# EAGLE design ReflowOvenController (EAGLE 7.6.0)
AUTHOR: w. boyett; CONTACT_ADDRESS: Licensed under CC-BY-SA; CONTACT_COMPANY: github.com/watsonboyett; CONTACT_PHONE: (Creative Commons, Attribution + Share Alike); REV: 1B
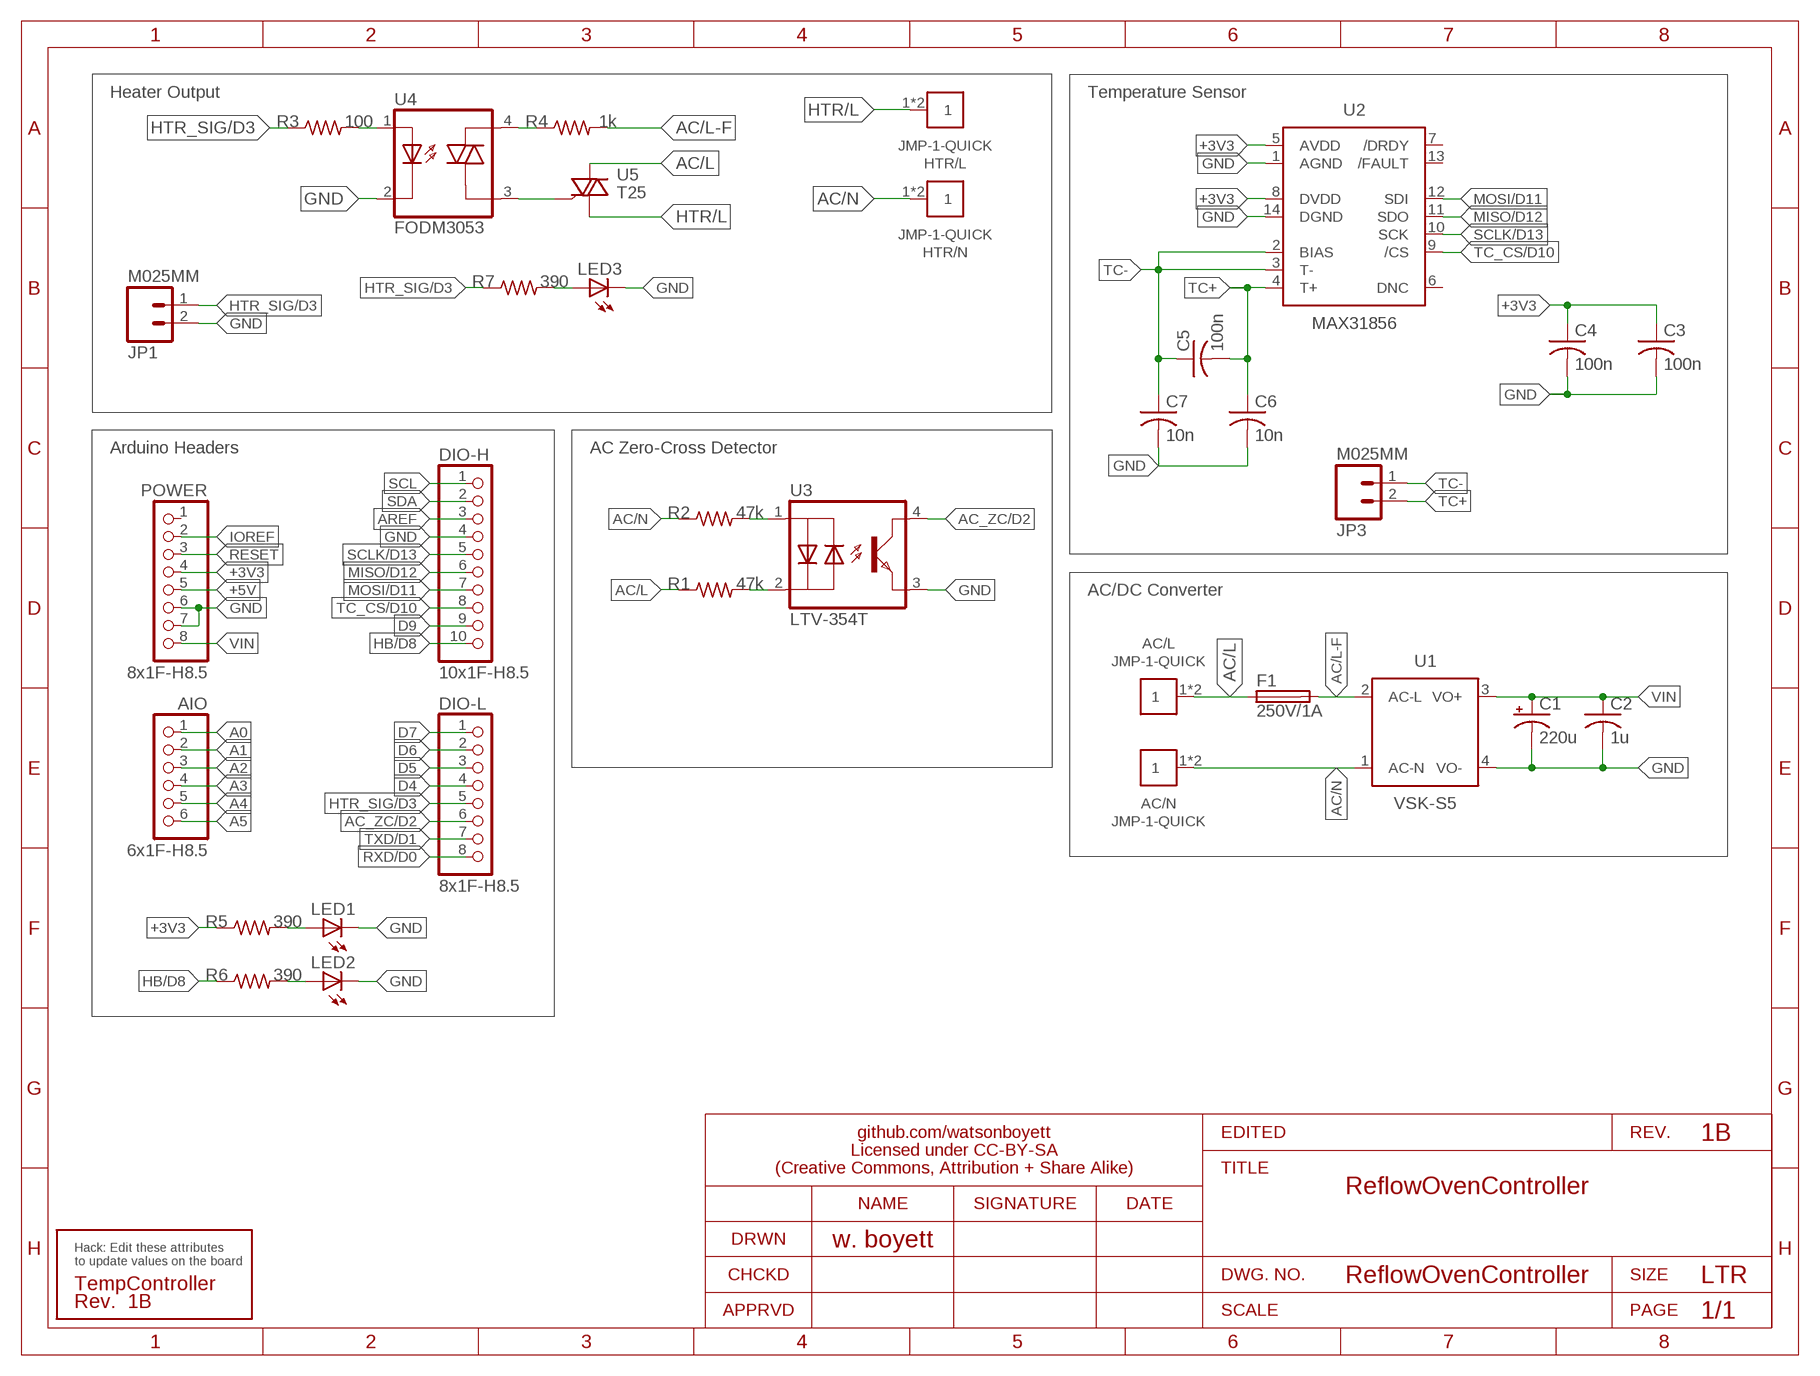
[diagram p0: schematic, sheet 1]

## Parts
AC/L  JMP-1-QUICK  [QUICK-1]
AC/N  JMP-1-QUICK  [QUICK-1]
AIO  6x1F-H8.5  PINHD-1X6TH  [1X06]
C1  220u  CPOL-US153CLV-1014  [153CLV-1014]
C2  1u  C-USC0805  [C0805]
C3  100n  C-USC0805  [C0805]
C4  100n  C-USC0805  [C0805]
C5  100n  C-USC0805  [C0805]
C6  10n  C-USC0805  [C0805]
C7  10n  C-USC0805  [C0805]
DIO-H  10x1F-H8.5  PINHD-1X10TH  [1X10]
DIO-L  8x1F-H8.5  PINHD-1X8TH  [1X08]
F1  250V/1A  FUSE2410  [2SMD-2410]
HTR/L  JMP-1-QUICK  [QUICK-1]
HTR/N  JMP-1-QUICK  [QUICK-1]
JP1  M025MM  [SCREWTERMINAL-5MM-2]
JP3  M025MM  [SCREWTERMINAL-5MM-2]
LED1  LEDCHIP-LED0805  [CHIP-LED0805]
LED2  LEDCHIP-LED0805  [CHIP-LED0805]
LED3  LEDCHIP-LED0805  [CHIP-LED0805]
POWER  8x1F-H8.5  PINHD-1X8TH  [1X08]
R1  47k  R-US_R1206  [R1206]
R2  47k  R-US_R1206  [R1206]
R3  100  R-US_R0805  [R0805]
R4  1k  R-US_R1206  [R1206]
R5  390  R-US_R0805  [R0805]
R6  390  R-US_R0805  [R0805]
R7  390  R-US_R0805  [R0805]
U1  VSK-S5  [VSK-S5]
U2  MAX31856  [TSSOP14]
U3  LTV-354T  [SOP-4]
U4  FODM3053  [SOP-4]
U5  T25  T835-TO263  [TO263-3]
U$1  SILK_QC  [SILK_QC]

## Nets
+3V3: C3.1 C4.1 POWER.4 R5.1 U2.5(AVDD) U2.8(DVDD)
+5V: POWER.5
A0: AIO.1
A1: AIO.2
A2: AIO.3
A3: AIO.4
A4: AIO.5
A5: AIO.6
AC/L [MAINS-HC]: AC/L.1 AC/L.2 F1.P$1 R1.1 U5.3(A2)
AC/L-F [MAINS-LC]: F1.P$2 R4.2 U1.2(AC-L)
AC/N [MAINS-HC]: AC/N.1 AC/N.2 HTR/N.1 HTR/N.2 R2.1 U1.1(AC-N)
AC_ZC/D2: DIO-L.6 U3.4(COL)
AREF: DIO-H.3
D4: DIO-L.4
D5: DIO-L.3
D6: DIO-L.2
D7: DIO-L.1
D9: DIO-H.9
GND: C1.- C2.2 C3.2 C4.2 C6.2 C7.2 DIO-H.4 JP1.2 LED1.C LED2.C LED3.C POWER.6 POWER.7 U1.4(VO-) U2.1(AGND) U2.14(DGND) U3.3(EMIT) U4.2(C)
HB/D8: DIO-H.10 R6.1
HTR/L [MAINS-HC]: HTR/L.1 HTR/L.2 U5.1(A1)
HTR_SIG/D3: DIO-L.5 JP1.1 R3.1 R7.1
IOREF: POWER.2
MISO/D12: DIO-H.6 U2.11(SDO)
MOSI/D11: DIO-H.7 U2.12(SDI)
N$1: R4.1 U4.4(A2)
N$2: R3.2 U4.1(A)
N$3 [MAINS-LC]: R1.2 U3.2(C)
N$4 [MAINS-LC]: R2.2 U3.1(A)
N$5: U4.3(A1) U5.2(G)
N$6: LED3.A R7.2
N$7: LED1.A R5.2
N$9: LED2.A R6.2
RESET: POWER.3
RXD/D0: DIO-L.8
SCL: DIO-H.1
SCLK/D13: DIO-H.5 U2.10(SCK)
SDA: DIO-H.2
TC+: C5.2 C6.1 JP3.2 U2.4(T+)
TC-: C5.1 C7.1 JP3.1 U2.2(BIAS) U2.3(T-)
TC_CS/D10: DIO-H.8 U2.9(/CS)
TXD/D1: DIO-L.7
VIN: C1.+ C2.1 POWER.8 U1.3(VO+)
Unconnected: POWER.1 U2.6(DNC) U2.7(/DRDY) U2.13(/FAULT)

## Notes on the sheet
- Heater Output | Temperature Sensor
- Arduino Headers | AC Zero-Cross Detector
- AC/DC Converter

## Library data of the parts
AC/L AC/N HTR/L HTR/N = ReflowOvenController:JMP-1; MPN: 1287; PN-DK: 36-1287-ND
AIO = ReflowOvenController:PINHD-1X6: PIN HEADER
C1 = ReflowOvenController:CPOL-US: POLARIZED CAPACITOR, American symbol; PN-DK: PCE3812CT-ND
C2-C7 = ReflowOvenController:C-US: CAPACITOR, American symbol
DIO-H = ReflowOvenController:PINHD-1X10: PIN HEADER
DIO-L POWER = ReflowOvenController:PINHD-1X8: PIN HEADER
F1 = ReflowOvenController:FUSE; MPN: 0454001.MR; PN-DK: F3144CT-ND
JP1 JP3 = SmslsTron:M02: 2-pin header 0.1" headers for use with - straight break away headers ( PRT-00116) - right angle break away headers (PRT-00553) - swiss pins (PRT-00743) - machine pins (PRT-00117) - female headers (PRT-00115) Molex polarized connector foot print use with: PRT-08233 with associated crimp pins and housings. 2.54_SCREWTERM for use with PRT-10571. 3.5mm Screw Terminal footprints for PRT-08084 5mm Screw Terminal footprints for use with PRT-08432; MPN: 1729128; PN-DK: 277-1247-ND
LED1 = SmslsTron:LED: LED OSRAM: - CHIPLED LG R971, LG N971, LY N971, LG Q971, LY Q971, LO R971, LY R971 LH N974, LH R974 LS Q976, LO Q976, LY Q976 LO Q996 - Hyper CHIPLED LW Q18S LB Q993, LB Q99A, LB R99A - SideLED LS A670, LO A670, LY A670, LG A670, LP A670 LB A673, LV A673, LT A673, LW A673 LH A674 LY A675 LS A676, LA A676, LO A676, LY A676, LW A676 LS A679, LY A679, LG A679 - Hyper Micro SIDELED® LS Y876, LA Y876, LO Y876, LY Y876 LT Y87S - SmartLED LW L88C, LW L88S LB L89C, LB L89S, LG L890 LS L89K, LO L89K, LY L89K LS L896, LA L896, LO L896, LY L896 - TOPLED LS T670, LO T670, LY T670, LG T670, LP T670 LSG T670, LSP T670, LSY T670, LOP T670, LYG T670 LG T671, LOG T671, LSG T671 LB T673, LV T673, LT T673, LW T673 LH T674 LS T676, LA T676, LO T676, LY T676, LB T676, LH T676, LSB T676, LW T676 LB T67C, LV T67C, LT T67C, LS T67K, LO T67K, LY T67K, LW E67C LS E67B, LA E67B, LO E67B, LY E67B, LB E67C, LV E67C, LT E67C LW T67C LS T679, LY T679, LG T679 LS T770, LO T770, LY T770, LG T770, LP T770 LB T773, LV T773, LT T773, LW T773 LH T774 LS E675, LA E675, LY E675, LS T675 LS T776, LA T776, LO T776, LY T776, LB T776 LHGB T686 LT T68C, LB T68C - Hyper Mini TOPLED® LB M676 - Mini TOPLED Santana® LG M470 LS M47K, LO M47K, LY M47K Source: http://www.osram.convergy.de LUXEON: - LUMILED® LXK2-PW12-R00, LXK2-PW12-S00, LXK2-PW14-U00, LXK2-PW14-V00 LXK2-PM12-R00, LXK2-PM12-S00, LXK2-PM14-U00 LXK2-PE12-Q00, LXK2-PE12-R00, LXK2-PE12-S00, LXK2-PE14-T00, LXK2-PE14-U00 LXK2-PB12-K00, LXK2-PB12-L00, LXK2-PB12-M00, LXK2-PB14-N00, LXK2-PB14-P00, LXK2-PB14-Q00 LXK2-PR12-L00, LXK2-PR12-M00, LXK2-PR14-Q00, LXK2-PR14-R00 LXK2-PD12-Q00, LXK2-PD12-R00, LXK2-PD12-S00 LXK2-PH12-R00, LXK2-PH12-S00 LXK2-PL12-P00, LXK2-PL12-Q00, LXK2-PL12-R00 Source: www.luxeon.com KINGBRIGHT: KA-3528ASYC Source: www.kingbright.com; LABEL: PWR; MPN: SML-LXT0805IW-TR; PN-DK: 67-1552-1-ND
LED2 = SmslsTron:LED: LED OSRAM: - CHIPLED LG R971, LG N971, LY N971, LG Q971, LY Q971, LO R971, LY R971 LH N974, LH R974 LS Q976, LO Q976, LY Q976 LO Q996 - Hyper CHIPLED LW Q18S LB Q993, LB Q99A, LB R99A - SideLED LS A670, LO A670, LY A670, LG A670, LP A670 LB A673, LV A673, LT A673, LW A673 LH A674 LY A675 LS A676, LA A676, LO A676, LY A676, LW A676 LS A679, LY A679, LG A679 - Hyper Micro SIDELED® LS Y876, LA Y876, LO Y876, LY Y876 LT Y87S - SmartLED LW L88C, LW L88S LB L89C, LB L89S, LG L890 LS L89K, LO L89K, LY L89K LS L896, LA L896, LO L896, LY L896 - TOPLED LS T670, LO T670, LY T670, LG T670, LP T670 LSG T670, LSP T670, LSY T670, LOP T670, LYG T670 LG T671, LOG T671, LSG T671 LB T673, LV T673, LT T673, LW T673 LH T674 LS T676, LA T676, LO T676, LY T676, LB T676, LH T676, LSB T676, LW T676 LB T67C, LV T67C, LT T67C, LS T67K, LO T67K, LY T67K, LW E67C LS E67B, LA E67B, LO E67B, LY E67B, LB E67C, LV E67C, LT E67C LW T67C LS T679, LY T679, LG T679 LS T770, LO T770, LY T770, LG T770, LP T770 LB T773, LV T773, LT T773, LW T773 LH T774 LS E675, LA E675, LY E675, LS T675 LS T776, LA T776, LO T776, LY T776, LB T776 LHGB T686 LT T68C, LB T68C - Hyper Mini TOPLED® LB M676 - Mini TOPLED Santana® LG M470 LS M47K, LO M47K, LY M47K Source: http://www.osram.convergy.de LUXEON: - LUMILED® LXK2-PW12-R00, LXK2-PW12-S00, LXK2-PW14-U00, LXK2-PW14-V00 LXK2-PM12-R00, LXK2-PM12-S00, LXK2-PM14-U00 LXK2-PE12-Q00, LXK2-PE12-R00, LXK2-PE12-S00, LXK2-PE14-T00, LXK2-PE14-U00 LXK2-PB12-K00, LXK2-PB12-L00, LXK2-PB12-M00, LXK2-PB14-N00, LXK2-PB14-P00, LXK2-PB14-Q00 LXK2-PR12-L00, LXK2-PR12-M00, LXK2-PR14-Q00, LXK2-PR14-R00 LXK2-PD12-Q00, LXK2-PD12-R00, LXK2-PD12-S00 LXK2-PH12-R00, LXK2-PH12-S00 LXK2-PL12-P00, LXK2-PL12-Q00, LXK2-PL12-R00 Source: www.luxeon.com KINGBRIGHT: KA-3528ASYC Source: www.kingbright.com; LABEL: HB; MPN: SML-LXT0805IW-TR; PN-DK: 67-1552-1-ND
LED3 = SmslsTron:LED: LED OSRAM: - CHIPLED LG R971, LG N971, LY N971, LG Q971, LY Q971, LO R971, LY R971 LH N974, LH R974 LS Q976, LO Q976, LY Q976 LO Q996 - Hyper CHIPLED LW Q18S LB Q993, LB Q99A, LB R99A - SideLED LS A670, LO A670, LY A670, LG A670, LP A670 LB A673, LV A673, LT A673, LW A673 LH A674 LY A675 LS A676, LA A676, LO A676, LY A676, LW A676 LS A679, LY A679, LG A679 - Hyper Micro SIDELED® LS Y876, LA Y876, LO Y876, LY Y876 LT Y87S - SmartLED LW L88C, LW L88S LB L89C, LB L89S, LG L890 LS L89K, LO L89K, LY L89K LS L896, LA L896, LO L896, LY L896 - TOPLED LS T670, LO T670, LY T670, LG T670, LP T670 LSG T670, LSP T670, LSY T670, LOP T670, LYG T670 LG T671, LOG T671, LSG T671 LB T673, LV T673, LT T673, LW T673 LH T674 LS T676, LA T676, LO T676, LY T676, LB T676, LH T676, LSB T676, LW T676 LB T67C, LV T67C, LT T67C, LS T67K, LO T67K, LY T67K, LW E67C LS E67B, LA E67B, LO E67B, LY E67B, LB E67C, LV E67C, LT E67C LW T67C LS T679, LY T679, LG T679 LS T770, LO T770, LY T770, LG T770, LP T770 LB T773, LV T773, LT T773, LW T773 LH T774 LS E675, LA E675, LY E675, LS T675 LS T776, LA T776, LO T776, LY T776, LB T776 LHGB T686 LT T68C, LB T68C - Hyper Mini TOPLED® LB M676 - Mini TOPLED Santana® LG M470 LS M47K, LO M47K, LY M47K Source: http://www.osram.convergy.de LUXEON: - LUMILED® LXK2-PW12-R00, LXK2-PW12-S00, LXK2-PW14-U00, LXK2-PW14-V00 LXK2-PM12-R00, LXK2-PM12-S00, LXK2-PM14-U00 LXK2-PE12-Q00, LXK2-PE12-R00, LXK2-PE12-S00, LXK2-PE14-T00, LXK2-PE14-U00 LXK2-PB12-K00, LXK2-PB12-L00, LXK2-PB12-M00, LXK2-PB14-N00, LXK2-PB14-P00, LXK2-PB14-Q00 LXK2-PR12-L00, LXK2-PR12-M00, LXK2-PR14-Q00, LXK2-PR14-R00 LXK2-PD12-Q00, LXK2-PD12-R00, LXK2-PD12-S00 LXK2-PH12-R00, LXK2-PH12-S00 LXK2-PL12-P00, LXK2-PL12-Q00, LXK2-PL12-R00 Source: www.luxeon.com KINGBRIGHT: KA-3528ASYC Source: www.kingbright.com; LABEL: SSR; MPN: SML-LXT0805IW-TR; PN-DK: 67-1552-1-ND
R1-R4 = ReflowOvenController:R-US_: RESISTOR, American symbol
R5-R7 = SmslsTron:R-US_: RESISTOR, American symbol
U1 = ReflowOvenController:VSK-S5; PN-DK: 102-2387-ND
U2 = ReflowOvenController:MAX31856; MPN: MAX31856MUD+; PN-DK: MAX31856MUD+-ND
U3 = ReflowOvenController:LTV-354T; MPN: LTV-354T; PN-DK: 160-1333-1-ND
U4 = ReflowOvenController:FODM3053; MPN: FODM3053R2_NF098; PN-DK: FODM3053R2_NF098CT-ND
U5 = ReflowOvenController:T835; PN-DK: 497-10581-1-ND
U$1 = SmslsTron:SILK_QC: Model/Version Tag Silkscreen; MPN: DNP; PRODUCT: TempController; REV: 1B

## Net classes
0 default: width 0.254 mm, clearance 0.254 mm
1 MAINS-LC: width 0.61 mm, drill 0.381 mm, clearance 2.286 mm
2 MAINS-HC: width 2.54 mm, drill 0.508 mm, clearance 2.286 mm

## Board
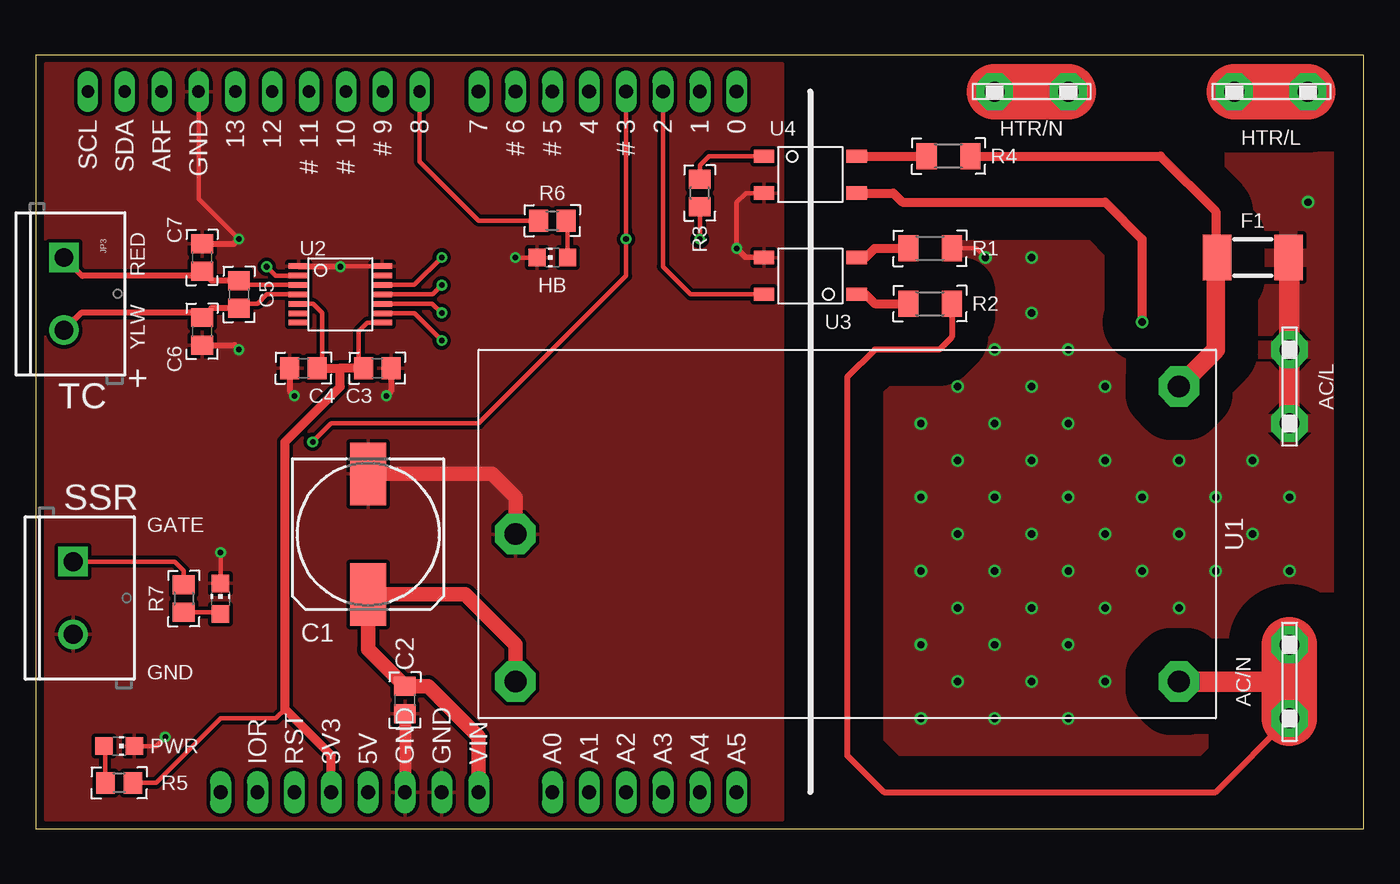
[diagram p1: board, top side]
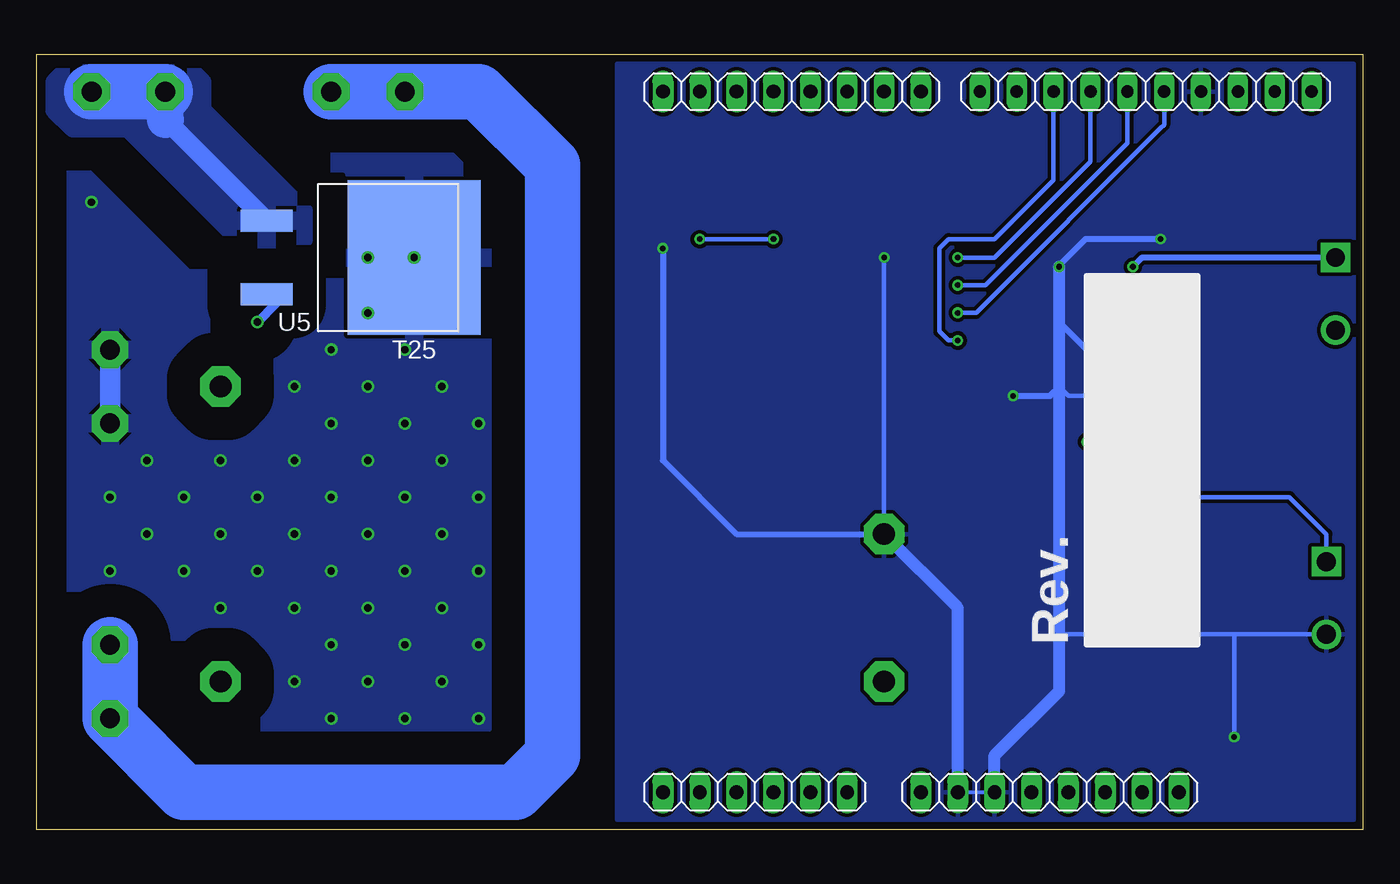
[diagram p2: board, bottom side, seen from below]

Size 91.44 x 53.34 mm. Coordinates in mm from the lower left corner, seen from the top.
Outline: 0,0 0,53.34 91.44,53.34 91.44,0 0,0
Copper layers (1*16): Top 0.0356mm / dielectric 1.5011mm / Bottom 0.0356mm
Design rules "OshPark-2layer-loosetol": minimum track width 10mil, minimum drill 15mil, track to track 8mil, track to pad 8mil, pad to pad 7mil, via to via 8mil, smd to smd 7mil, copper to edge 15mil, drill to drill 6mil, minimum pad ring 10mil, minimum via ring 7mil, stop-mask expansion 2.5mil, vias tented up to drill 20mil, thermal gap 10mil

### Footprints (pad centres in the part's own frame; a part is rotated, then mirrored left to right if it is on the bottom)
QUICK-1 = drill 1.372 pad 2.54 octagon: 1 -2.54,0; 2 2.54,0
1X06 = drill 0.95 pad 1.422 long: 1 -6.35,0; 2 -3.81,0; 3 -1.27,0; 4 1.27,0; 5 3.81,0; 6 6.35,0
153CLV-1014 = smd 4.3 x 2.5: + 4.15,0; - -4.15,0
C0805 = smd 1.3 x 1.5: 1 -0.95,0; 2 0.95,0
1X10 = drill 0.85 pad 1.422 long: 1 -11.43,0; 2 -8.89,0; 3 -6.35,0; 4 -3.81,0; 5 -1.27,0; 6 1.27,0; 7 3.81,0; 8 6.35,0; 9 8.89,0; 10 11.43,0
1X08 = drill 0.95 pad 1.422 long: 1 -8.89,0; 2 -6.35,0; 3 -3.81,0; 4 -1.27,0; 5 1.27,0; 6 3.81,0; 7 6.35,0; 8 8.89,0
2SMD-2410 = smd 1.956 x 3.15: P$1 -2.464,0; P$2 2.464,0
SCREWTERMINAL-5MM-2 = drill 1.3 pad 2.032 square: 1 0,0 | drill 1.3 pad 2.032: 2 5,0
CHIP-LED0805 = smd 1.2 x 1.2: A 1.05,0; C -1.05,0
R1206 = smd 1.4 x 1.8: 1 -1.5,0; 2 1.5,0
R0805 = smd 1.3 x 1.5: 1 -0.95,0; 2 0.95,0
VSK-S5 = drill 1.499 pad 2.794 octagon: 1 -22.86,10.16; 2 -22.86,-10.16; 3 22.86,10.16; 4 22.86,0
TSSOP14 = smd 0.38 x 1.4: 1 -1.95,-2.875; 2 -1.3,-2.875; 3 -0.65,-2.875; 4 0,-2.875; 5 0.65,-2.875; 6 1.3,-2.875; 7 1.95,-2.875; 8 1.95,2.875; 9 1.3,2.875; 10 0.65,2.875; 11 0,2.875; 12 -0.65,2.875; 13 -1.3,2.875; 14 -1.95,2.875
SOP-4 = smd 1.4 x 0.9: 1 3.2,-1.27; 2 3.2,1.27; 3 -3.2,1.27; 4 -3.2,-1.27
TO263-3 = smd 1.524 x 3.556: 1 -2.54,-10.16; 2 2.54,-10.16 | smd 10.668 x 9.144: 3 0,0

### Placement (x,y rotation side)
AC/L  86.36,30.48 270 top
AC/N  86.36,10.16 90 top
AIO  41.91,2.54 180 bottom
C1  22.86,20.32 270 top
C2  25.4,8.89 270 top
C3  23.5,31.75 0 top
C4  18.41,31.75 180 top
C5  13.97,36.83 270 top
C6  11.43,34.29 270 top
C7  11.43,39.37 90 top
DIO-H  14.99,50.8 180 bottom
DIO-L  39.37,50.8 180 bottom
F1  83.82,39.37 180 top
HTR/L  85.09,50.8 0 top
HTR/N  68.58,50.8 0 top
JP1  2.54,18.41 270 top
JP3  1.91,39.37 270 top
LED1  5.71,5.71 180 top
LED2  35.56,39.37 0 top
LED3  12.7,15.88 270 top
POWER  21.59,2.54 180 bottom
R1  61.59,40.01 180 top
R2  61.59,36.2 180 top
R3  45.72,43.81 90 top
R4  62.87,46.35 0 top
R5  5.71,3.17 180 top
R6  35.56,41.91 0 top
R7  10.16,15.88 270 top
U1  55.88,20.32 180 top
U2  20.95,36.83 270 top
U3  53.34,38.1 0 top
U4  53.34,45.09 180 top
U5  65.41,39.37 270 bottom
U$1  20.32,12.7 90 bottom

### Tracks (layer width: path | path; a pad name or v marks a point on that pad's centre or on a via)
+3V3
  Top 0.305: 19.68,32.07 19.68,35.56 19.07,36.18 U2.5 | 22.23,32.07 22.23,34.29 22.82,34.88 U2.8 | R5.1 8.26,3.17 12.7,7.62 16.51,7.62 17.14,8.26
  Top 0.406: 19.68,32.07 C4.1 | 22.23,32.07 C3.1
  Top 0.61: POWER.4 20.32,5.08 17.14,8.26 17.14,19.68 17.14,24.77 17.14,26.67 20.95,30.48 20.95,31.75 | C3.1 20.95,31.75 | C4.1 20.95,31.75
AC/L  (via drill 0.51)
  Top 0.305: R1.1 64.77,40.01 U5.3
  Top 0.61: 86.36,39.45 F1.P$1
  Top 1.422: AC/L.2 AC/L.1 86.36,39.29 F1.P$1
  Bottom 1.27: AC/L.2 AC/L.1
  Bottom 1.422: AC/L.1 AC/L.2
  other vias: 65.41,39.37 68.58,39.37 68.58,35.56 60.96,27.94 66.04,27.94 63.5,25.4 66.04,22.86 60.96,22.86 60.96,17.78 60.96,12.7 60.96,7.62 63.5,10.16 63.5,15.24 63.5,20.32 66.04,17.78 66.04,12.7 66.04,7.62 68.58,10.16 68.58,15.24 68.58,20.32 68.58,25.4 68.58,30.48 63.5,30.48 71.12,27.94 73.66,30.48 73.66,25.4 71.12,22.86 71.12,17.78 73.66,20.32 76.2,22.86 71.12,12.7 73.66,15.24 76.2,17.78 78.74,20.32 78.74,15.24 78.74,25.4 81.28,22.86 81.28,17.78 83.82,20.32 71.12,7.62 73.66,10.16 83.82,25.4 86.36,22.86 86.36,17.78 87.63,43.18 71.12,33.02 66.04,33.02
  pour Bottom (isolate 2.032, rank 2): 55.88,50.8 88.9,50.8 88.9,2.54 55.88,2.54
  pour Top (isolate 2.032): 55.88,50.8 88.9,50.8 88.9,2.54 55.88,2.54
AC/L-F
  Top 0.61: R4.2 77.47,46.35 81.28,42.55 81.28,39.45 F1.P$2
  Top 1.27: U1.2 81.28,33.02 81.28,39.29 F1.P$2
AC/N
  Top 0.406: R2.1 63.09,33.88 62.23,33.02 57.78,33.02 55.88,31.11 55.88,5.08 58.42,2.54 81.28,2.54 AC/N.1
  Top 1.422: U1.1 86.36,10.16
  Top 3.81: AC/N.1 86.36,10.16 AC/N.2 | HTR/N.1 HTR/N.2
  Bottom 1.422: 86.36,10.16 AC/N.1
  Bottom 3.81: HTR/N.2 HTR/N.1 60.96,50.8 55.88,45.72 55.88,5.08 58.42,2.54 81.28,2.54 AC/N.1 86.36,10.16 AC/N.2
AC_ZC/D2
  Top 0.305: DIO-L.6 43.18,38.73 45.09,36.83 U3.4
GND  (via drill 0.38)
  Top 0.305: U2.14 21,38.78 | DIO-H.4 11.18,43.43 v13.97,40.64 | LED3.C v12.7,19.05 | LED1.C 8.26,5.71 v8.89,6.35 | LED2.C v33.02,39.37 | U4.2 48.9,43.81 48.26,43.18 v48.26,40.01
  Top 0.406: U2.1 20.91,38.78 | 20.91,38.78 v20.95,38.73 21,38.78 | 20.95,38.83 20.91,38.78 | C7.2 13.65,40.32 v13.97,40.64 | C6.2 13.65,33.34 v13.97,33.02 | C3.2 24.45,30.16 v24.13,29.84 | C4.2 17.46,30.16 v17.78,29.84 | U3.3 48.87,39.4 v48.26,40.01
  Top 0.813: C2.2 POWER.6
  Top 1.016: U1.4 33.02,22.86 31.41,24.47 C1.-
  Bottom 0.254: POWER.7 POWER.6
  Bottom 0.305: JP1.2 8.89,13.41 | v17.78,29.84 20.32,29.84 20.95,30.48 | v33.02,39.37 U1.4 | 8.89,13.41 12.7,13.41 | 12.7,13.41 20.88,13.41 20.95,13.34 | v12.7,19.05 12.7,13.41 | v8.89,6.35 8.89,13.41
  Bottom 0.406: v13.97,40.64 19.14,40.64 20.95,38.83 v20.95,38.73 | v13.97,33.02 19.05,33.02 20.95,34.92 | v24.13,29.84 21.59,29.84 20.95,30.48 | v48.26,40.01 48.26,25.4 43.18,20.32 U1.4
  Bottom 0.813: POWER.7 27.94,15.24 U1.4 | POWER.6 25.4,5.08 20.95,9.53 20.95,13.34 20.95,30.48 20.95,34.92 v20.95,38.73
  pour Bottom (rank 2): 0.64,52.7 0.64,0.64 51.44,0.64 51.44,52.7
  pour Top (rank 2): 0.64,52.7 0.64,0.64 51.44,0.64 51.44,52.7
HB/D8
  Top 0.305: DIO-H.10 26.42,45.97 27.94,44.45 30.48,41.91 R6.1
HTR/L
  Top 3.81: HTR/L.1 HTR/L.2
  Bottom 1.27: U5.1 82.55,48.9
  Bottom 2.54: 82.55,48.9 HTR/L.1
  Bottom 3.81: HTR/L.1 HTR/L.2
  pour Bottom: 73.03,40.64 73.03,42.55 80.01,49.53 80.01,51.44 80.64,52.07 89.53,52.07 90.17,51.44 90.17,49.53 88.9,48.26 85.09,48.26 77.47,40.64
HTR_SIG/D3  (via drill 0.38)
  Top 0.305: v40.64,40.64 40.64,41.27 | 40.64,41.27 DIO-L.5 | R3.1 v45.72,40.64 | v40.64,40.64 40.64,41.27 | v19.05,26.67 20.32,27.94 27.94,27.94 30.48,27.94 40.64,38.1 v40.64,40.64 | R7.1 10.16,17.78 9.53,18.41 JP1.1
  Bottom 0.305: v45.72,40.64 v40.64,40.64 | JP1.1 2.54,20.32 5.08,22.86 15.24,22.86 v19.05,26.67
MISO/D12  (via drill 0.38)
  Top 0.305: U2.11 27.3,36.83 v27.94,37.47
  Bottom 0.305: v27.94,37.47 26.04,37.47 16.51,46.99 16.26,47.24 DIO-H.6
MOSI/D11  (via drill 0.38)
  Top 0.305: U2.12 26.02,37.48 v27.94,39.37
  Bottom 0.305: v27.94,39.37 25.4,39.37 19.05,45.72 18.8,45.97 DIO-H.7
N$1
  Top 0.61: U4.4 R4.1
N$2
  Top 0.305: R3.2 45.72,45.72 46.35,46.35 U4.1
N$3
  Top 0.61: U3.2 57.15,39.37 57.78,40.01 R1.2
N$4
  Top 0.61: U3.1 57.15,36.83 57.78,36.2 R2.2
N$5  (via drill 0.51)
  Top 0.61: U4.3 59.05,43.81 59.69,43.18 73.66,43.18 76.2,40.64 v76.2,34.92
  Bottom 0.61: v76.2,34.92 74.93,36.2 U5.2
N$6
  Top 0.305: R7.2 12.6,14.93 LED3.A
N$7
  Top 0.305: R5.2 4.76,5.62 LED1.A
N$9
  Top 0.305: LED2.A 36.61,41.81 R6.2
SCLK/D13  (via drill 0.38)
  Top 0.305: U2.10 27.29,36.18 v27.94,35.56
  Bottom 0.305: v27.94,35.56 26.67,35.56 13.97,48.26 13.72,48.51 DIO-H.5
TC+
  Top 0.305: U2.4 15.88,36.83 15.24,36.2 14.29,36.2
  Top 0.406: 14.29,36.2 C5.2 12.07,35.88 C6.1 11.11,35.56 3.1,35.56 JP3.2
TC-  (via drill 0.38)
  Top 0.305: U2.3 14.27,37.48 | U2.2 16.48,38.13 v15.88,38.73
  Top 0.406: 14.27,37.48 C5.1 12.07,37.78 C7.1 11.11,38.1 3.17,38.1 JP3.1
  Bottom 0.406: JP3.1 15.24,39.37 v15.88,38.73
TC_CS/D10  (via drill 0.38)
  Top 0.305: U2.9 25.37,35.53 26.07,35.53 v27.94,33.66
  Bottom 0.305: v27.94,33.66 28.57,33.66 29.21,34.29 29.21,40.01 28.57,40.64 25.4,40.64 21.59,44.45 21.34,44.7 DIO-H.8
VIN
  Top 1.016: POWER.8 30.48,6.35 26.99,9.84 C2.1 22.86,12.38 C1.+ 29.55,16.17 33.02,12.7 U1.3

### Text on the board
tPlace: RED | YLW | + | TC | SSR | GATE | GND
tNames: SCL | SDA | ARF | GND | 13 | 12 | 11 | 10 | 9 | 8 | 7 | 6 | 5 | 4 | 3 | 2 | 1 | 0 | # | # | # | # | # | # | IOR | RST | 3V3 | 5V | GND | GND | VIN | A0 | A1 | A2 | A3 | A4 | A5
214bmp: D:/SmartProjects/Snc/a4_bn_logo2.bmp